# Altium schematic sheet L50T-TEST.SchDoc
size A2
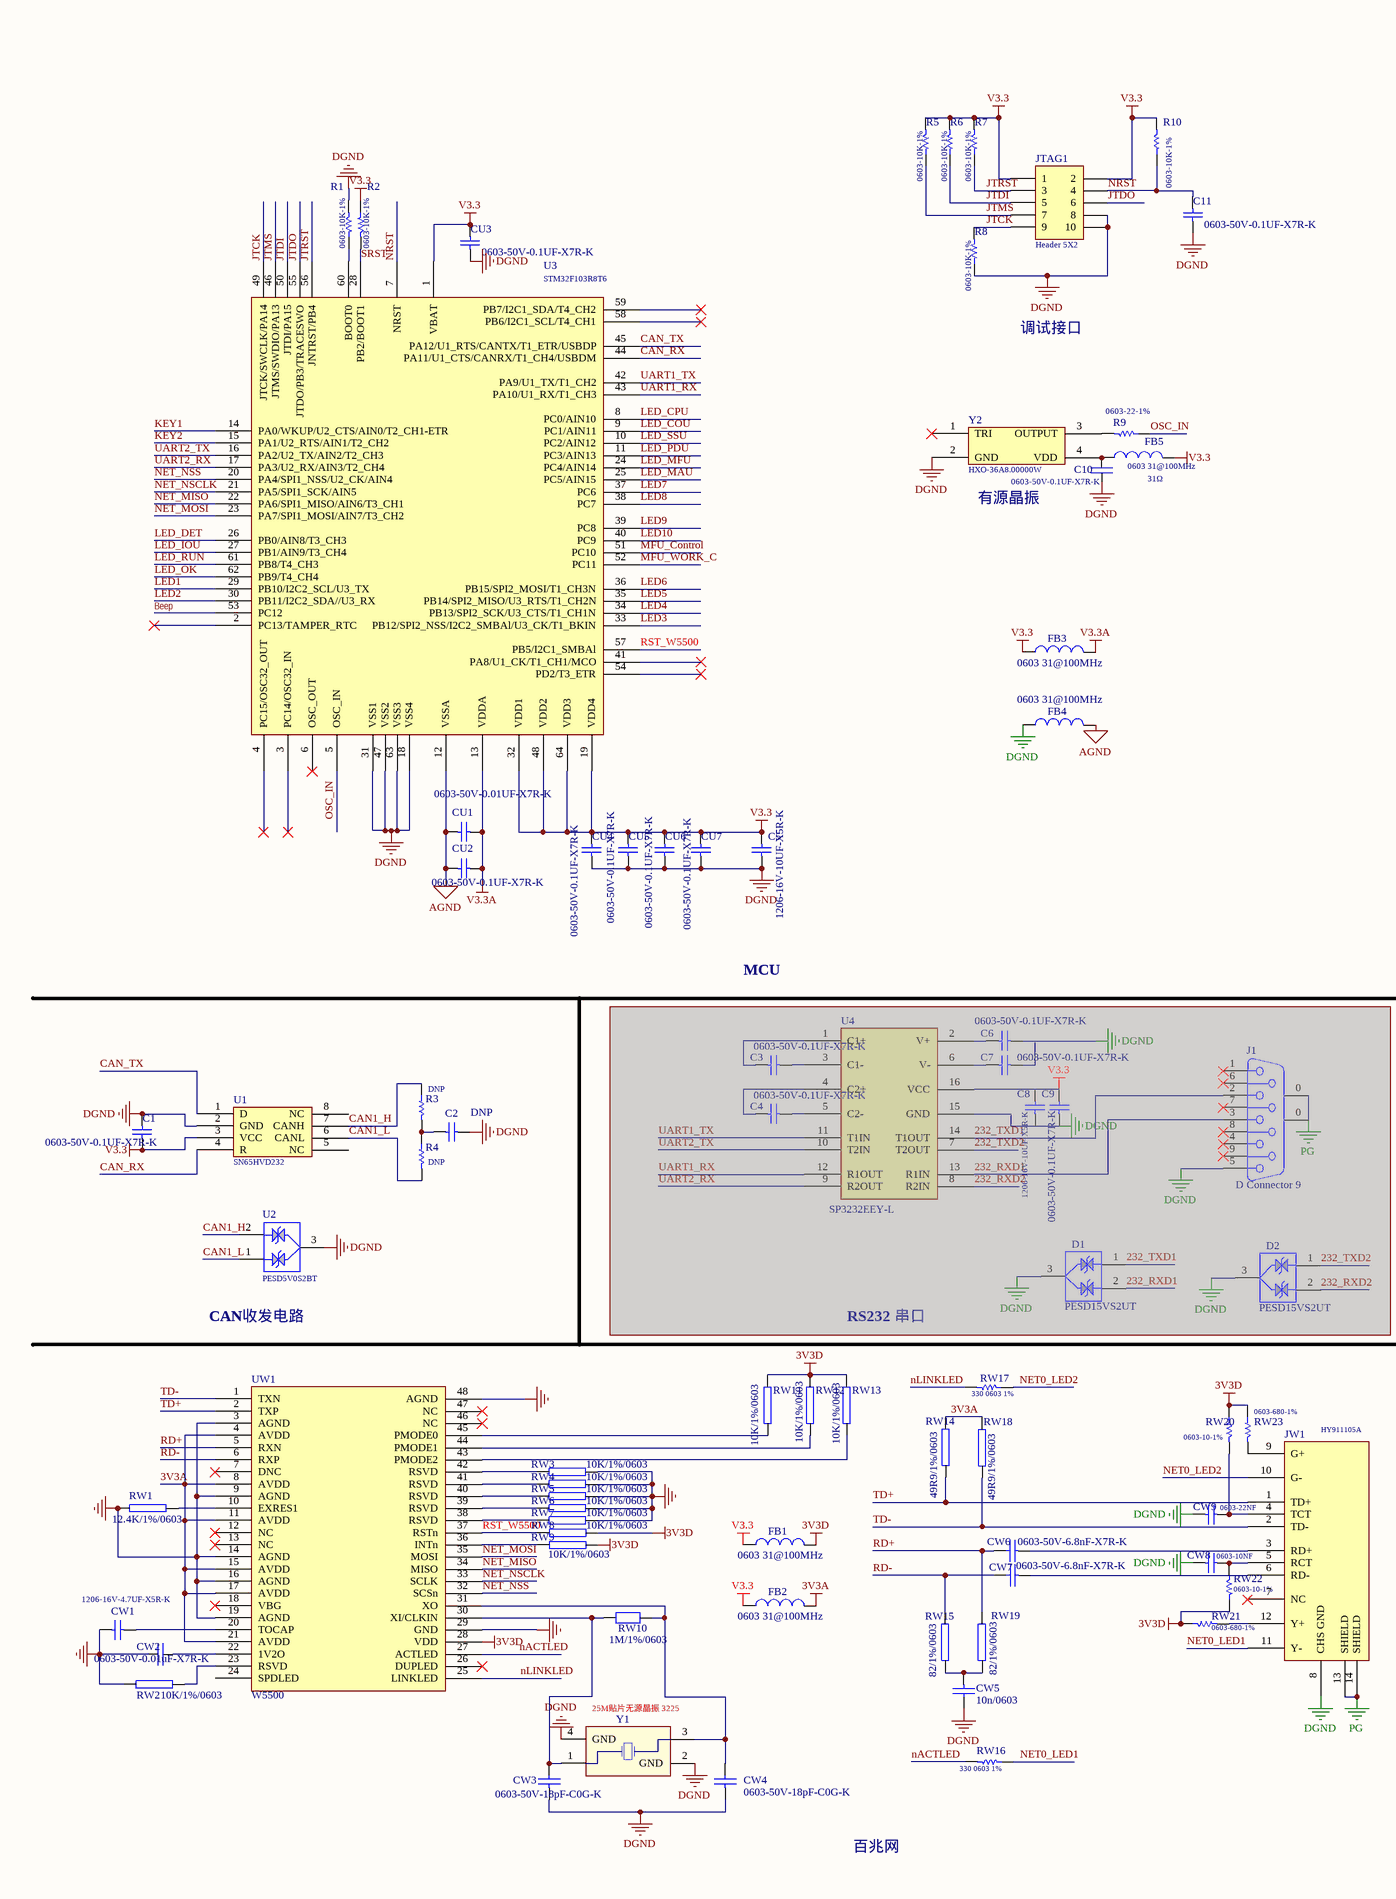
[diagram p0: L50T-TEST.SchDoc, left]
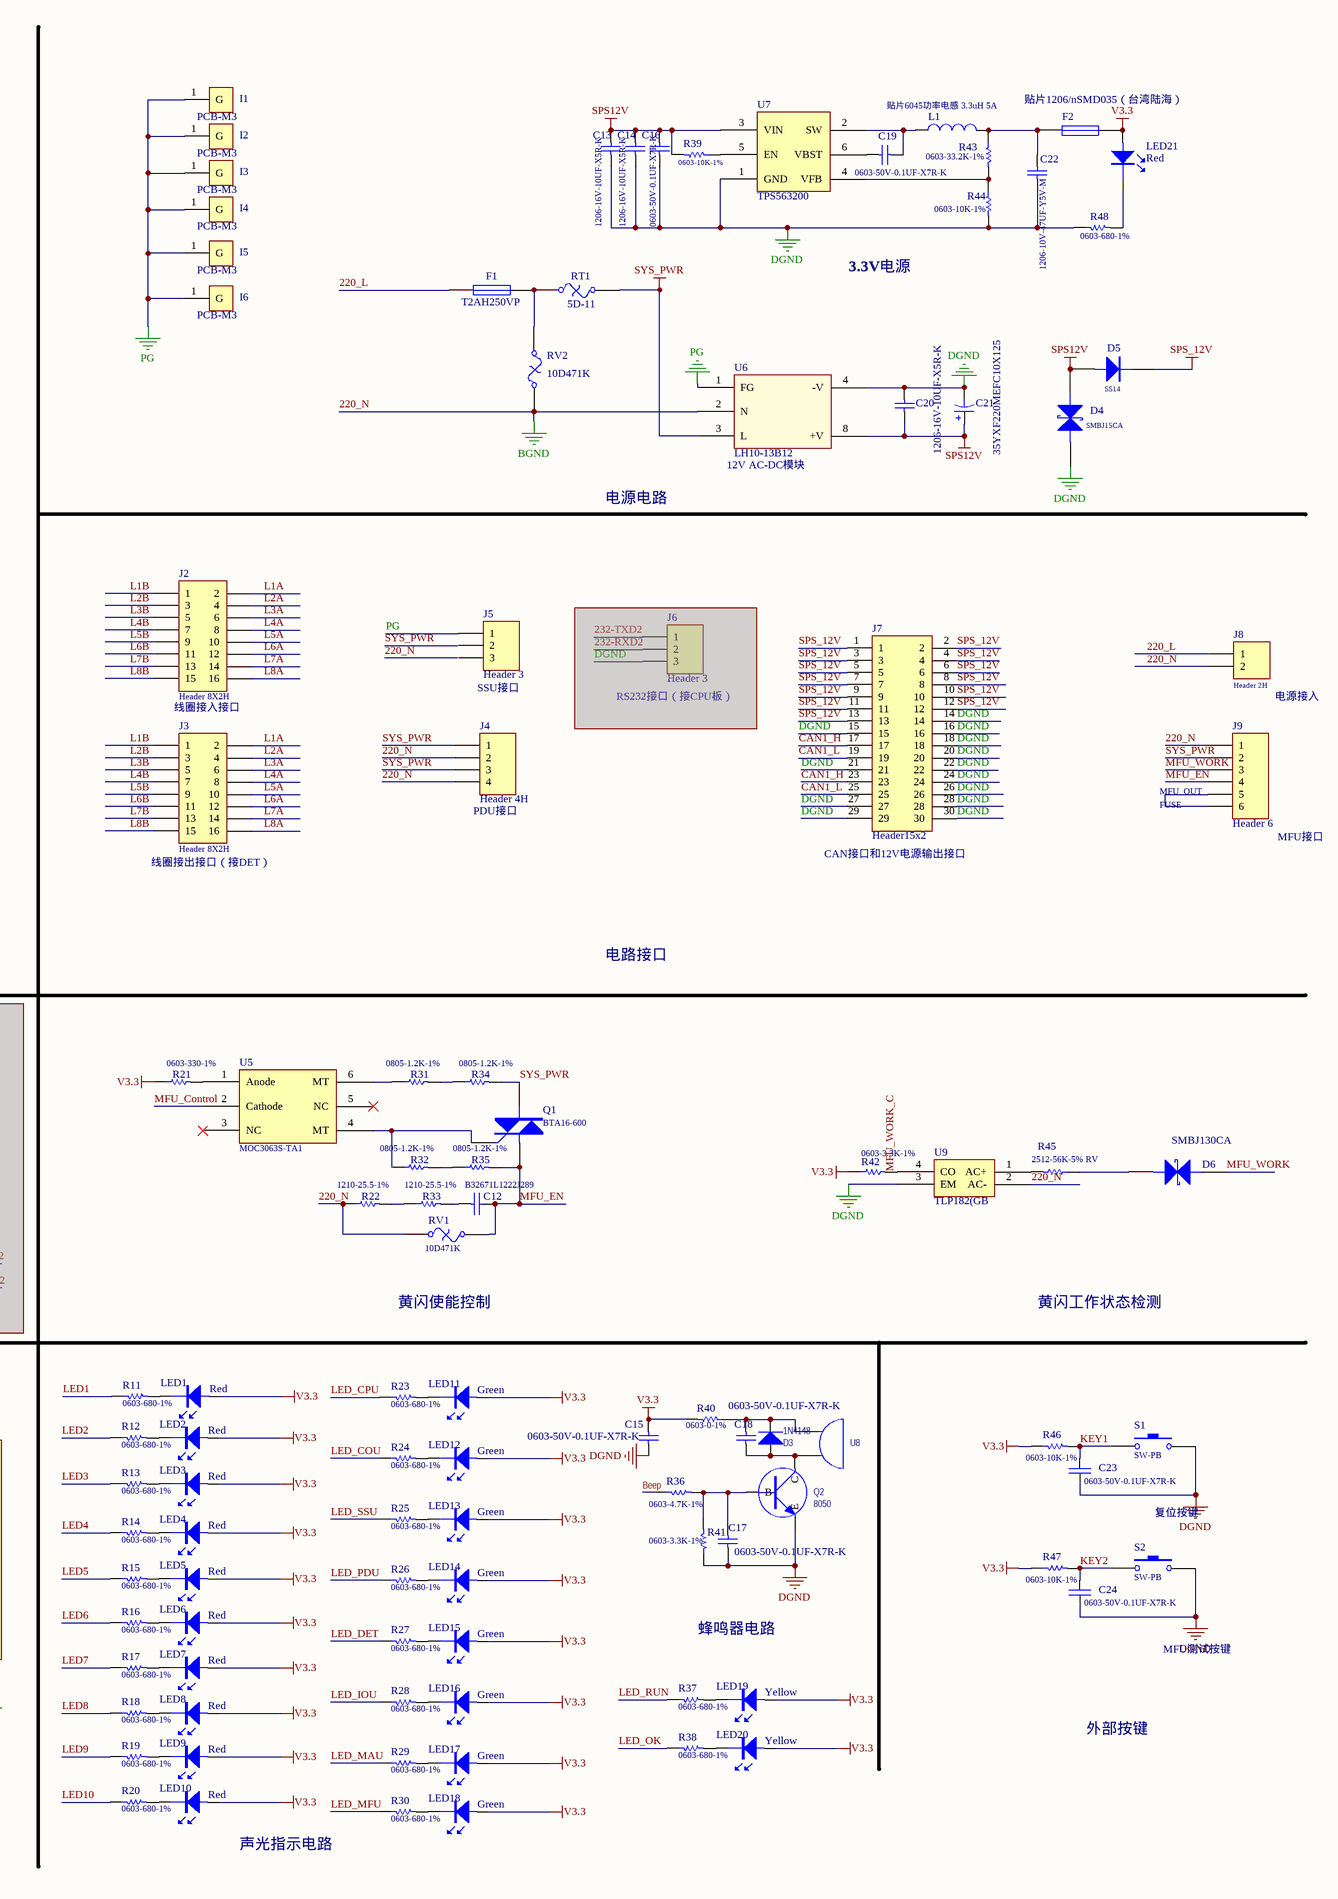
[diagram p1: L50T-TEST.SchDoc, right]

## Parts
C1  0603-50V-0.1UF-X7R-K  [0603C]
C2  DNP  [0603C]
C3  0603-50V-0.1UF-X7R-K  [0603C]  (masked out: inside a compile mask, not in the netlist)
C4  0603-50V-0.1UF-X7R-K  [0603C]  (masked out: inside a compile mask, not in the netlist)
C5  1206-16V-10UF-X5R-K  [1206C]
C6  0603-50V-0.1UF-X7R-K  [0603C]  (masked out: inside a compile mask, not in the netlist)
C7  0603-50V-0.1UF-X7R-K  [0603C]  (masked out: inside a compile mask, not in the netlist)
C8  1206-16V-10UF-X5R-K  [1206C]  (masked out: inside a compile mask, not in the netlist)
C9  0603-50V-0.1UF-X7R-K  [0603C]  (masked out: inside a compile mask, not in the netlist)
C10  0603-50V-0.1UF-X7R-K  [0603c]
C11  0603-50V-0.1UF-X7R-K  [0603C]
C12  B32671L1222J289  [CAP-10-5]
C13  1206-16V-10UF-X5R-K  [1206C]
C14  1206-16V-10UF-X5R-K  [1206C]
C15  0603-50V-0.1UF-X7R-K  [0603C]
C16  0603-50V-0.1UF-X7R-K  [0603C]
C17  0603-50V-0.1UF-X7R-K  [0603C]
C18  0603-50V-0.1UF-X7R-K  [0603C]
C19  0603-50V-0.1UF-X7R-K  [0603C]
C20  1206-16V-10UF-X5R-K  [1206C]
C21  35YXF220MEFC10X125  [RB.2/.4]
C22  1206-10V-47UF-Y5V-M  [1206C]
C23  0603-50V-0.1UF-X7R-K  [0603C]
C24  0603-50V-0.1UF-X7R-K  [0603C]
CU1  0603-50V-0.01UF-X7R-K  [0603C]
CU2  0603-50V-0.1UF-X7R-K  [0603C]
CU3  0603-50V-0.1UF-X7R-K  [0603C]
CU4  0603-50V-0.1UF-X7R-K  [0603C]
CU5  0603-50V-0.1UF-X7R-K  [0603C]
CU6  0603-50V-0.1UF-X7R-K  [0603C]
CU7  0603-50V-0.1UF-X7R-K  [0603C]
CW1  1206-16V-4.7UF-X5R-K  [1206C]
CW2  0603-50V-0.01uF-X7R-K  [0603C]
CW3  0603-50V-18pF-C0G-K  [0603C]
CW4  0603-50V-18pF-C0G-K  [0603C]
CW5  10n/0603  [0603C]
CW6  0603-50V-6.8nF-X7R-K  [0603C]
CW7  0603-50V-6.8nF-X7R-K  [0603C]
CW8  0603-10NF  [0603C]
CW9  0603-22NF  [0603C]
D1  PESD15VS2UT  [SOT-23]  (masked out: inside a compile mask, not in the netlist)
D2  PESD15VS2UT  [SOT-23]  (masked out: inside a compile mask, not in the netlist)
D3  1N4148  [SOD-323]
D4  SMBJ15CA  [SMB-TVS]
D5  SS14  [SMA]
D6  SMBJ130CA  [SMB-TVS]
F1  T2AH250VP  [FUSE-BF013]
F2  贴片1206/nSMD035（台湾陆海）  [1206F]
FB1  0603 31@100MHz  [0603L]
FB2  0603 31@100MHz  [0603L]
FB3  0603 31@100MHz  [0603L]
FB4  0603 31@100MHz  [0603L]
FB5  0603 31@100MHz  value 31Ω  [0603L]
I1  PCB-M3  [PADS_M3]
I2  PCB-M3  [PADS_M3]
I3  PCB-M3  [PADS_M3]
I4  PCB-M3  [PADS_M3]
I5  PCB-M3  [PADS_M3]
I6  PCB-M3  [PADS_M3]
J1  D Connector 9  [DB-9/F]  (masked out: inside a compile mask, not in the netlist)
J2  Header 8X2H  [KF2EDGKRHM-5.08-8]
J3  Header 8X2H  [KF2EDGKRHM-5.08-8]
J4  Header 4H  [CON4-7.62-32A]
J5  Header 3  [CON-3-5.08]
J6  Header 3  [CON-3-5.08]  (masked out: inside a compile mask, not in the netlist)
J7  Header15x2  [IDC-30-2.0-C]
J8  Header 2H  [CON-2-5.08]
J9  Header 6  [CON-6-5.08]
JTAG1  Header 5X2  [IDC-10-B]
JW1  HY911105A  [HY911105A]
L1  贴片6045功率电感 3.3uH 5A  [L-6045]
LED1  Red  [LED-0603]
LED2  Red  [LED-0603]
LED3  Red  [LED-0603]
LED4  Red  [LED-0603]
LED5  Red  [LED-0603]
LED6  Red  [LED-0603]
LED7  Red  [LED-0603]
LED8  Red  [LED-0603]
LED9  Red  [LED-0603]
LED10  Red  [LED-0603]
LED11  Green  [LED-0603]
LED12  Green  [LED-0603]
LED13  Green  [LED-0603]
LED14  Green  [LED-0603]
LED15  Green  [LED-0603]
LED16  Green  [LED-0603]
LED17  Green  [LED-0603]
LED18  Green  [LED-0603]
LED19  Yellow  [LED-0603]
LED20  Yellow  [LED-0603]
LED21  Red  [LED-0603]
Q1  BTA16-600  [TO-220AB-C]
Q2  8050  [SOT-23]
R1  0603-10K-1%  [0603R]
R2  0603-10K-1%  [0603R]
R3  DNP  [0603R]
R4  DNP  [0603R]
R5  0603-10K-1%  [0603R]
R6  0603-10K-1%  [0603R]
R7  0603-10K-1%  [0603R]
R8  0603-10K-1%  [0603R]
R9  0603-22-1%  [0603R]
R10  0603-10K-1%  [0603R]
R11  0603-680-1%  [0603R]
R12  0603-680-1%  [0603R]
R13  0603-680-1%  [0603R]
R14  0603-680-1%  [0603R]
R15  0603-680-1%  [0603R]
R16  0603-680-1%  [0603R]
R17  0603-680-1%  [0603R]
R18  0603-680-1%  [0603R]
R19  0603-680-1%  [0603R]
R20  0603-680-1%  [0603R]
R21  0603-330-1%  [0603R]
R22  1210-25.5-1%  [1210R]
R23  0603-680-1%  [0603R]
R24  0603-680-1%  [0603R]
R25  0603-680-1%  [0603R]
R26  0603-680-1%  [0603R]
R27  0603-680-1%  [0603R]
R28  0603-680-1%  [0603R]
R29  0603-680-1%  [0603R]
R30  0603-680-1%  [0603R]
R31  0805-1.2K-1%  [0805R]
R32  0805-1.2K-1%  [0805R]
R33  1210-25.5-1%  [1210R]
R34  0805-1.2K-1%  [0805R]
R35  0805-1.2K-1%  [0805R]
R36  0603-4.7K-1%  [0603R]
R37  0603-680-1%  [0603R]
R38  0603-680-1%  [0603R]
R39  0603-10K-1%  [0603R]
R40  0603-0-1%  [0603R]
R41  0603-3.3K-1%  [0603R]
R42  0603-3.3K-1%  [0603R]
R43  0603-33.2K-1%  [0603R]
R44  0603-10K-1%  [0603R]
R45  2512-56K-5% RV  [2512R]
R46  0603-10K-1%  [0603R]
R47  0603-10K-1%  [0603R]
R48  0603-680-1%  [0603R]
RT1  5D-11  [10D471K]
RV1  10D471K  [10D471K]
RV2  10D471K  [10D471K]
RW1  12.4K/1%/0603  [0603R]
RW2  10K/1%/0603  [0603R]
RW3  10K/1%/0603  [0603R]
RW4  10K/1%/0603  [0603R]
RW5  10K/1%/0603  [0603R]
RW6  10K/1%/0603  [0603R]
RW7  10K/1%/0603  [0603R]
RW8  10K/1%/0603  [0603R]
RW9  10K/1%/0603  [0603R]
RW10  1M/1%/0603  [0603R]
RW11  10K/1%/0603  [0603R]
RW12  10K/1%/0603  [0603R]
RW13  10K/1%/0603  [0603R]
RW14  49R9/1%/0603  [0603R]
RW15  82/1%/0603  [0603R]
RW16  330 0603 1%  [0603R]
RW17  330 0603 1%  [0603R]
RW18  49R9/1%/0603  [0603R]
RW19  82/1%/0603  [0603R]
RW20  0603-10-1%  [0603R]
RW21  0603-680-1%  [0603R]
RW22  0603-10-1%  [0603R]
RW23  0603-680-1%  [0603R]
S1  SW-PB  [KEY-6*6*7]
S2  SW-PB  [KEY-6*6*7]
U1  SN65HVD232  [SO-8]
U2  PESD5V0S2BT  [SOT-23]
U3  STM32F103R8T6  [STM-LQFP64_N]
U4  SP3232EEY-L  [TSSOP-16]  (masked out: inside a compile mask, not in the netlist)
U5  MOC3063S-TA1  [MOC3063]
U6  LH10-13B12  [AC-DC-10W]
U7  TPS563200  [TSOT23-6]
U8  BUZZER  [BUZZ-.28/.46 -SMT]  (value not drawn)
U9  TLP182(GB  [SO-4-2.54]
UW1  W5500  [LQFP-48]
Y1  25M贴片无源晶振 3225  [OSC3225_4P]
Y2  HXO-36A8.00000W  [XTAL-C]

## Nets
3V3A: FB2.2 RW14.2 RW18.2 UW1.4(AVDD) UW1.8(AVDD) UW1.11(AVDD) UW1.15(AVDD) UW1.17(AVDD) UW1.21(AVDD)
3V3D: FB1.2 RW8.2 RW9.2 RW11.2 RW12.2 RW13.2 RW20.1 RW21.1 RW22.1 RW23.1 UW1.28(VDD)
220_N: J4.2 J4.4 J8.2 J9.1 R22.1 RV1.1 RV2.1 U6.2(N) U9.2(AC-)  [also labelled BGND]
AGND: CU1.2 CU2.2 FB4.2 U3.12(VSSA)
DGND: C1.2 C2.1 C5.1 C10.2 C11.1 C13.1 C14.1 C15.2 C16.2 C17.1 C20.2 C21.2 C22.1 C23.2 C24.2 CU3.1 CU4.1 CU5.1 CU6.1 CU7.1 CW1.2 CW2.2 CW3.1 CW4.1 CW5.2 CW8.2 CW9.2 D4.1(A) FB4.1 J7.14 J7.15 J7.16 J7.18 J7.20 J7.21 J7.22 J7.24 J7.26 J7.27 J7.28 J7.29 J7.30 JTAG1.8 JTAG1.10 JW1.8(CHS_GND) Q2.2(E) R1.2 R8.1 R41.1 R44.2 R48.1 RW1.2 RW2.2 RW3.1 RW4.1 RW5.1 RW6.1 RW7.1 S1.1 S2.1 U1.2(GND) U2.3 U3.18(VSS4) U3.31(VSS1) U3.47(VSS2) U3.63(VSS3) U6.4(-V) U7.1(GND) U9.3(EM) UW1.3(AGND) UW1.9(AGND) UW1.14(AGND) UW1.16(AGND) UW1.19(AGND) UW1.29(GND) UW1.48(AGND) Y1.2(GND) Y1.4(GND) Y2.2(GND)
PG: I1.1(G) I2.1(G) I3.1(G) I4.1(G) I5.1(G) I6.1(G) J5.1 JW1.13(SHIELD) JW1.14(SHIELD) U6.1(FG)
SPS12V: C13.2 C14.2 C16.1 C20.1 C21.1 D4.2(K) D5.1 R39.2 U6.8(+V) U7.3(VIN)
SPS_12V: D5.2 J7.1 J7.2 J7.3 J7.4 J7.5 J7.6 J7.7 J7.8 J7.9 J7.10 J7.11 J7.12 J7.13
SYS_PWR: J4.1 J4.3 J9.2 Q1.2(T) R34.2 RT1.2 U6.3(L)
V3.3: C1.1 C5.2 C15.1 CU3.2 CU4.2 CU5.2 CU6.2 CU7.2 F2.2 FB1.1 FB2.1 FB3.1 FB5.2 JTAG1.1 JTAG1.2 LED1.1 LED2.1 LED3.1 LED4.1 LED5.1 LED6.1 LED7.1 LED8.1 LED9.1 LED10.1 LED11.1 LED12.1 LED13.1 LED14.1 LED15.1 LED16.1 LED17.1 LED18.1 LED19.1 LED20.1 LED21.1 R2.1 R5.2 R6.2 R7.2 R10.2 R21.1 R40.2 R42.1 R46.1 R47.1 U1.3(VCC) U3.1(VBAT) U3.19(VDD4) U3.32(VDD1) U3.48(VDD2) U3.64(VDD3)
V3.3A: CU1.1 CU2.1 FB3.2 U3.13(VDDA)
220_L: F1.1 J8.1
Beep: R36.1 U3.53(PC12)
CAN1_H: J7.17 J7.23 R3.1 U1.7(CANH) U2.2
CAN1_L: J7.19 J7.25 R4.2 U1.6(CANL) U2.1
CAN_RX: U1.4(R) U3.44(PA11/U1_CTS/CANRX/T1_CH4/USBDM)
CAN_TX: U1.1(D) U3.45(PA12/U1_RTS/CANTX/T1_ETR/USBDP)
JTCK: JTAG1.9 R8.2 U3.49(JTCK/SWCLK/PA14)
JTDI: JTAG1.5 R6.1 U3.50(JTDI/PA15)
JTDO: JTAG1.6 U3.55(JTDO/PB3/TRACESWO)
JTMS: JTAG1.7 R5.1 U3.46(JTMS/SWDIO/PA13)
JTRST: JTAG1.3 R7.1 U3.56(JNTRST/PB4)
KEY1: C23.1 R46.2 S1.2 U3.14(PA0/WKUP/U2_CTS/AIN0/T2_CH1-ETR)
KEY2: C24.1 R47.2 S2.2 U3.15(PA1/U2_RTS/AIN1/T2_CH2)
L1A: J2.2 J3.2
L1B: J2.1 J3.1
L2A: J2.4 J3.4
L2B: J2.3 J3.3
L3A: J2.6 J3.6
L3B: J2.5 J3.5
L4A: J2.8 J3.8
L4B: J2.7 J3.7
L5A: J2.10 J3.10
L5B: J2.9 J3.9
L6A: J2.12 J3.12
L6B: J2.11 J3.11
L7A: J2.14 J3.14
L7B: J2.13 J3.13
L8A: J2.16 J3.16
L8B: J2.15 J3.15
LED1: R11.1 U3.29(PB10/I2C2_SCL/U3_TX)
LED2: R12.1 U3.30(PB11/I2C2_SDA//U3_RX)
LED3: R13.1 U3.33(PB12/SPI2_NSS/I2C2_SMBAl/U3_CK/T1_BKIN)
LED4: R14.1 U3.34(PB13/SPI2_SCK/U3_CTS/T1_CH1N)
LED5: R15.1 U3.35(PB14/SPI2_MISO/U3_RTS/T1_CH2N)
LED6: R16.1 U3.36(PB15/SPI2_MOSI/T1_CH3N)
LED7: R17.1 U3.37(PC6)
LED8: R18.1 U3.38(PC7)
LED9: R19.1 U3.39(PC8)
LED10: R20.1 U3.40(PC9)
LED_COU: R24.1 U3.9(PC1/AIN11)
LED_CPU: R23.1 U3.8(PC0/AIN10)
LED_DET: R27.1 U3.26(PB0/AIN8/T3_CH3)
LED_IOU: R28.1 U3.27(PB1/AIN9/T3_CH4)
LED_MAU: R29.1 U3.25(PC5/AIN15)
LED_MFU: R30.1 U3.24(PC4/AIN14)
LED_OK: R38.1 U3.62(PB9/T4_CH4)
LED_PDU: R26.1 U3.11(PC3/AIN13)
LED_RUN: R37.1 U3.61(PB8/T4_CH3)
LED_SSU: R25.1 U3.10(PC2/AIN12)
MFU_Control: U3.51(PC10) U5.2(Cathode)
MFU_EN: C12.2 J9.4 Q1.1(T) R35.2 RV1.2
MFU_WORK: D6.2(K) J9.3
MFU_WORK_C: R42.2 U3.52(PC11) U9.4(CO)
nACTLED: RW16.2 UW1.27(ACTLED)
NET0_LED1: JW1.11(Y-) RW16.1
NET0_LED2: JW1.10(G-) RW17.1
NET_MISO: U3.22(PA6/SPI1_MISO/AIN6/T3_CH1) UW1.34(MISO)
NET_MOSI: U3.23(PA7/SPI1_MOSI/AIN7/T3_CH2) UW1.35(MOSI)
NET_NSCLK: U3.21(PA5/SPI1_SCK/AIN5) UW1.33(SCLK)
NET_NSS: U3.20(PA4/SPI1_NSS/U2_CK/AIN4) UW1.32(SCSn)
nLINKLED: RW17.2 UW1.25(LINKLED)
NRST: C11.2 JTAG1.4 R10.1 U3.7(NRST)
OSC_IN: R9.1 U3.5(OSC_IN)
RD+: CW6.2 RW19.2 UW1.5(RXN)
RD-: CW7.2 RW15.2 UW1.6(RXP)
RST_W5500: RW8.1 U3.57(PB5/I2C1_SMBAl) UW1.37(RSTn)
SRST: R2.2 U3.28(PB2/BOOT1)
TD+: JW1.1(TD+) RW14.1 UW1.2(TXP)
TD-: JW1.2(TD-) RW18.1 UW1.1(TXN)
UART1_RX: U3.43(PA10/U1_RX/T1_CH3)
UART1_TX: U3.42(PA9/U1_TX/T1_CH2)
UART2_RX: U3.17(PA3/U2_RX/AIN3/T2_CH4)
UART2_TX: U3.16(PA2/U2_TX/AIN2/T2_CH3)
NetC2_2: C2.2 R3.2 R4.1
NetC10_1: C10.1 FB5.1 Y2.4(VDD)
NetC12_1: C12.1 R33.2
NetC17_2: C17.2 Q2.1(B) R36.2 R41.2
NetC18_1: C18.1 D3.2(K) R40.1 U8.1(A)
NetC18_2: C18.2 D3.1(A) Q2.3(C) U8.2(B)
NetC19_1: C19.1 L1.1 U7.2(SW)
NetC19_2: C19.2 U7.6(VBST)
NetC22_2: C22.2 F2.1 L1.2 R43.1
NetCW1_1: CW1.1 UW1.20(TOCAP)
NetCW2_1: CW2.1 UW1.22(1V2O)
NetCW3_2: CW3.2 RW10.2 UW1.30(XI/CLKIN) Y1.1(OSC1)
NetCW4_2: CW4.2 RW10.1 UW1.31(XO) Y1.3
NetCW5_1: CW5.1 RW15.1 RW19.1
NetCW6_1: CW6.1 JW1.3(RD+)
NetCW7_1: CW7.1 JW1.6(RD-)
NetCW8_1: CW8.1 JW1.5(RCT) RW22.2
NetCW9_1: CW9.1 JW1.4(TCT) RW20.2
NetD6_1: D6.1(A) R45.1
NetF1_2: F1.2 RT1.1 RV2.2
NetJ9_5: J9.5 J9.6
NetJW1_9: JW1.9(G+) RW23.2
NetJW1_12: JW1.12(Y+) RW21.2
NetLED1_2: LED1.2 R11.2
NetLED2_2: LED2.2 R12.2
NetLED3_2: LED3.2 R13.2
NetLED4_2: LED4.2 R14.2
NetLED5_2: LED5.2 R15.2
NetLED6_2: LED6.2 R16.2
NetLED7_2: LED7.2 R17.2
NetLED8_2: LED8.2 R18.2
NetLED9_2: LED9.2 R19.2
NetLED10_2: LED10.2 R20.2
NetLED11_2: LED11.2 R23.2
NetLED12_2: LED12.2 R24.2
NetLED13_2: LED13.2 R25.2
NetLED14_2: LED14.2 R26.2
NetLED15_2: LED15.2 R27.2
NetLED16_2: LED16.2 R28.2
NetLED17_2: LED17.2 R29.2
NetLED18_2: LED18.2 R30.2
NetLED19_2: LED19.2 R37.2
NetLED20_2: LED20.2 R38.2
NetLED21_2: LED21.2 R48.2
NetQ1_3: Q1.3(G) R32.1 U5.4(MT)
NetR1_1: R1.1 U3.60(BOOT0)
NetR9_2: R9.2 Y2.3(OUTPUT)
NetR21_2: R21.2 U5.1(Anode)
NetR22_2: R22.2 R33.1
NetR31_1: R31.1 U5.6(MT)
NetR31_2: R31.2 R34.1
NetR32_2: R32.2 R35.1
NetR39_1: R39.1 U7.5(EN)
NetR43_2: R43.2 R44.1 U7.4(VFB)
NetR45_2: R45.2 U9.1(AC+)
NetRW1_1: RW1.1 UW1.10(EXRES1)
NetRW2_1: RW2.1 UW1.23(RSVD)
NetRW3_2: RW3.2 UW1.42(RSVD)
NetRW4_2: RW4.2 UW1.41(RSVD)
NetRW5_2: RW5.2 UW1.40(RSVD)
NetRW6_2: RW6.2 UW1.39(RSVD)
NetRW7_2: RW7.2 UW1.38(RSVD)
NetRW9_1: RW9.1 UW1.36(INTn)
NetRW11_1: RW11.1 UW1.45(PMODE0)
NetRW12_1: RW12.1 UW1.44(PMODE1)
NetRW13_1: RW13.1 UW1.43(PMODE2)

Not connected (* = marked no-connect by the designer): J5 2 3; JW1 7(NC)*; U1 5(NC) 8(NC); U3 2(PC13/TAMPER_RTC)* 3(PC14/OSC32_IN)* 4(PC15/OSC32_OUT)* 6(OSC_OUT)* 41(PA8/U1_CK/T1_CH1/MCO)* 54(PD2/T3_ETR)* 58(PB6/I2C1_SCL/T4_CH1)* 59(PB7/I2C1_SDA/T4_CH2)*; U5 3(NC)* 5(NC)*; UW1 7(DNC)* 12(NC)* 13(NC)* 18(VBG)* 24(SPDLED) 26(DUPLED)* 46(NC)* 47(NC)*; Y2 1(TRI)*

## Notes on the sheet
- 3.3V电源
- 调试接口
- (near Y2) 有源晶振
- 电源电路
- (near U6) 12V AC-DC模块
- 线圈接入接口
- (near J5) SSU接口
- (near J6) RS232接口（接CPU板）
- 电源接入
- (near J4) PDU接口
- MFU_OUT
- FUSE
- (near J3) 线圈接出接口（接DET）
- (near J7) CAN接口和12V电源输出接口
- (near J9) MFU接口
- MCU
- 电路接口
- CAN收发电路
- RS232 串口
- 黄闪使能控制
- 黄闪工作状态检测
- 复位按键
- 蜂鸣器电路
- MFU测试按键
- 外部按键
- 百兆网
- (near LED10) 声光指示电路

## Library data of the parts
C1 C2 = Cap: Capacitor; Value: 104 0603 50V 10%; Published: 8-Jun-2000; LatestRevisionDate: 17-Jul-2002; LatestRevisionNote: Re-released for DXP Platform.; PackageReference: RAD-0.3; Publisher: Altium Limited
C3 C4 C9 = Cap: Capacitor; Published: 8-Jun-2000; LatestRevisionDate: 17-Jul-2002; LatestRevisionNote: Re-released for DXP Platform.; PackageReference: RAD-0.3; Publisher: Altium Limited; PackageDescription: Radial Cap, Thru-Hole; 2 Leads; 0.3 in Pin Spacing; Value: 0603-50V-0.1UF-X7R-K
C5 = Cap: Capacitor; Value: 10u; Published: 8-Jun-2000; LatestRevisionDate: 17-Jul-2002; LatestRevisionNote: Re-released for DXP Platform.; PackageReference: RAD-0.3; Publisher: Altium Limited; PackageDescription: Radial Cap, Thru-Hole; 2 Leads; 0.3 in Pin Spacing
C6 C7 = Cap: Capacitor; RATED VOLTAGE: 10V; Published: 8-Jun-2000; LatestRevisionDate: 17-Jul-2002; LatestRevisionNote: Re-released for DXP Platform.; PackageReference: RAD-0.3; Publisher: Altium Limited; PackageDescription: Radial Cap, Thru-Hole; 2 Leads; 0.3 in Pin Spacing; Value: 0603-50V-0.1UF-X7R-K
C8 C13 C14 C16 C19 C22 = Cap: Capacitor; Value: 0.1u; Published: 8-Jun-2000; LatestRevisionDate: 17-Jul-2002; LatestRevisionNote: Re-released for DXP Platform.; PackageReference: RAD-0.3; Publisher: Altium Limited; PackageDescription: Radial Cap, Thru-Hole; 2 Leads; 0.3 in Pin Spacing
C10 C12 C23 C24 CW2 = CAP: Capacitor
C11 CU3-CU7 = Cap: Capacitor; Value: 0.1uF 0603 50V 10%; Published: 8-Jun-2000; LatestRevisionDate: 17-Jul-2002; LatestRevisionNote: Re-released for DXP Platform.; PackageReference: RAD-0.3; Publisher: Altium Limited
C15 C17 C18 = Cap: Capacitor; Value: 0603B472J500NT; Published: 8-Jun-2000; LatestRevisionDate: 17-Jul-2002; LatestRevisionNote: Re-released for DXP Platform.; PackageReference: RAD-0.3; Publisher: Altium Limited
C20 = Cap: Capacitor; Value: 1uF; Published: 8-Jun-2000; LatestRevisionDate: 17-Jul-2002; LatestRevisionNote: Re-released for DXP Platform.; PackageReference: RAD-0.3; Publisher: Altium Limited; PackageDescription: Radial Cap, Thru-Hole; 2 Leads; 0.3 in Pin Spacing
C21 = Cap Pol1: Polarized Capacitor (Radial); Value: 220uF; Published: 8-Jun-2000; LatestRevisionDate: 17-Jul-2002; LatestRevisionNote: Re-released for DXP Platform.; PackageReference: RB7.6-15; Publisher: Altium Limited; PackageDescription: Polarized Capacitor (Radial); 2 Leads
CU1 = Cap: Capacitor; Value: 0603B102J500NT; Published: 8-Jun-2000; LatestRevisionDate: 17-Jul-2002; LatestRevisionNote: Re-released for DXP Platform.; PackageReference: RAD-0.3; Publisher: Altium Limited
CU2 = Cap: Capacitor; Value: 1206B/105J500NT; Published: 8-Jun-2000; LatestRevisionDate: 17-Jul-2002; LatestRevisionNote: Re-released for DXP Platform.; PackageReference: RAD-0.3; Publisher: Altium Limited
CW1 = Cap: 贴片电容; Value: 0.1u; Published: 8-Jun-2000; LatestRevisionDate: 17-Jul-2002; LatestRevisionNote: Re-released for DXP Platform.; PackageReference: RAD-0.3; Publisher: Altium Limited; PackageDescription: Radial Cap, Thru-Hole; 2 Leads; 0.3 in Pin Spacing
CW3-CW7 = CAP: Capacitor; Value: 39pF
CW8 CW9 = Cap: Capacitor; Value: 0603B103J500NT; Published: 8-Jun-2000; LatestRevisionDate: 17-Jul-2002; LatestRevisionNote: Re-released for DXP Platform.; PackageReference: RAD-0.3; Publisher: Altium Limited
D1 D2 U2 = NUP2105L: TVS protect
D3 = Diode 1N4148: High Conductance Fast Diode; Published: 8-Jun-2000; LatestRevisionDate: 17-Jul-2002; LatestRevisionNote: Re-released for DXP Platform.; DatasheetVersion: 1997; PackageReference: DO-35; Publisher: Altium Limited; Code_JEDEC: DO-204-AH; ComponentLink1Description: Manufacturer Link; ComponentLink1URL: http://www.fairchildsemi.com/; ComponentLink2Description: Datasheet; ComponentLink2URL: http://www.fairchildsemi.com/ds/1N%2F1N4148.pdf
D4 D6 = TVSC
D5 = DIODE
F1 F2 = Fuse 1: Fuse; Published: 8-Jun-2000; LatestRevisionDate: 17-Jul-2002; LatestRevisionNote: Re-released for DXP Platform.; PackageReference: PIN-W2/E2.8; Publisher: Altium Limited; PackageDescription: Thru-Hole; 2 Leads
FB1-FB4 = Inductor: Code_IEC: 1005; Value: 31Ω; Published: 8-Jun-2000; LatestRevisionDate: 29-May-2009; LatestRevisionNote: IPC-7351 Footprint Added.; PackageReference: 0402-A; Publisher: Altium Limited; PackageDescription: Chip Inductor; Code_JEITA: 0402
FB5 L1 = Inductor: Code_IEC: 1005; Published: 8-Jun-2000; LatestRevisionDate: 29-May-2009; LatestRevisionNote: IPC-7351 Footprint Added.; PackageReference: 0402-A; Publisher: Altium Limited; PackageDescription: Chip Inductor; Code_JEITA: 0402
I1-I6 = PCB-M
J1 = D Connector 9: Receptacle Assembly, 9 Position, Right Angle; PackageDocument: O; Positions: 9; Published: 15-Jun-2001; LatestRevisionDate: 17-Jul-2002; LatestRevisionNote: Re-released for DXP Platform.; DatasheetDocument: 1-Sep-1999; PackageReference: 788750; Publisher: Altium Limited; Orientation: Right Angle; Gender: Receptacle
J2 J3 = Header 8X2H: Header, 8-Pin, Dual row, Right Angle; LatestRevisionDate: 17-Jul-2002; LatestRevisionNote: Re-released for DXP Platform.; Publisher: Altium Limited
J4 = Header 4H: Header, 4-Pin, Right Angle; LatestRevisionDate: 17-Jul-2002; LatestRevisionNote: Re-released for DXP Platform.; Publisher: Altium Limited
J5 J6 = Header 3: Header, 3-Pin; LatestRevisionDate: 17-Jul-2002; LatestRevisionNote: Re-released for DXP Platform.; Publisher: Altium Limited
J8 = Header 2H: Header, 2-Pin, Right Angle; LatestRevisionDate: 17-Jul-2002; LatestRevisionNote: Re-released for DXP Platform.; Publisher: Altium Limited
J9 = Header 6: Header, 6-Pin; LatestRevisionDate: 17-Jul-2002; LatestRevisionNote: Re-released for DXP Platform.; Publisher: Altium Limited
JTAG1 = Header 5X2: Header, 5-Pin, Dual row; LatestRevisionDate: 17-Jul-2002; LatestRevisionNote: Re-released for DXP Platform.; Publisher: Altium Limited
LED1-LED21 = LED
Q1 = TRIAC: 使用黑色散热片,宽15*齿高10*长22mm,孔18mm
Q2 = NPN: NPN Transistor
R1-R20 R23-R30 R36-R41 R43 R44 R46-R48 RW16 RW17 RW20-RW23 = Res1: Resistor; Value: 1K; Published: 8-Jun-2000; LatestRevisionDate: 17-Jul-2002; LatestRevisionNote: Re-released for DXP Platform.; PackageReference: AXIAL-0.3; Publisher: Altium Limited
R21 R42 R45 = Res Semi: Semiconductor Resistor; Value: 1K; Published: 8-Jun-2000; LatestRevisionDate: 17-Jul-2002; LatestRevisionNote: Re-released for DXP Platform.; PackageReference: AXIAL-0.5; Publisher: Altium Limited; PackageDescription: Axial Device, Thru-Hole; 2 Leads; 0.5 in Pin Spacing
R22 R33 = Res Semi: Semiconductor Resistor; Value: 25.5ohm; Published: 8-Jun-2000; LatestRevisionDate: 17-Jul-2002; LatestRevisionNote: Re-released for DXP Platform.; PackageReference: AXIAL-0.5; Publisher: Altium Limited; PackageDescription: Axial Device, Thru-Hole; 2 Leads; 0.5 in Pin Spacing
R31 R32 R34 R35 = Res Semi: Semiconductor Resistor; Value: 1.2Kohm; Published: 8-Jun-2000; LatestRevisionDate: 17-Jul-2002; LatestRevisionNote: Re-released for DXP Platform.; PackageReference: AXIAL-0.5; Publisher: Altium Limited; PackageDescription: Axial Device, Thru-Hole; 2 Leads; 0.5 in Pin Spacing
RT1 RV1 RV2 = Fuse Thermal: Thermal Fuse; Published: 24-Mar-1999; LatestRevisionDate: 17-Jul-2002; LatestRevisionNote: Re-released for DXP Platform.; PackageReference: PIN-W2/E2.8; Publisher: Altium Limited; PackageDescription: Thru-Hole; 2 Leads
RW1-RW9 RW11-RW15 RW18 RW19 = RES1
RW10 = Res2: Resistor; Published: 8-Jun-2000; LatestRevisionDate: 17-Jul-2002; LatestRevisionNote: Re-released for DXP Platform.; Publisher: Altium Limited; Value: 1M/1%/0603
S1 S2 = SW-PB: Switch; Published: 24-Mar-1999; LatestRevisionDate: 17-Jul-2002; LatestRevisionNote: Re-released for DXP Platform.; PackageReference: SPST-2; Publisher: Altium Limited
U3 = STM32F103R8T6: LQFP64
U4 = SP3232EEY
U5 = MOC3063S
U6 = AC-DC-12-10W
U7 = TPS562200
U8 = BUZZER: TMB12A03
U9 = TLP126
Y1 = OSC5032: Crystal Oscillator; Published: 8-Jun-2000; LatestRevisionDate: 17-Jul-2002; LatestRevisionNote: Re-released for DXP Platform.; PackageReference: R38; Publisher: Altium Limited; PackageDescription: Crystal, Thru-Hole; 2 Leads; Body 3.1 x 8.2 mm (Dia.xH)
Y2 = osc
U1 = SN65HVD232: Supplier 1: Digi-Key; Supplier Part Number 1: 296-12282-5-ND
UW1 = W5500: Value: W5500